# Altium project arduino_voltage_monitor_shield.PrjPCB
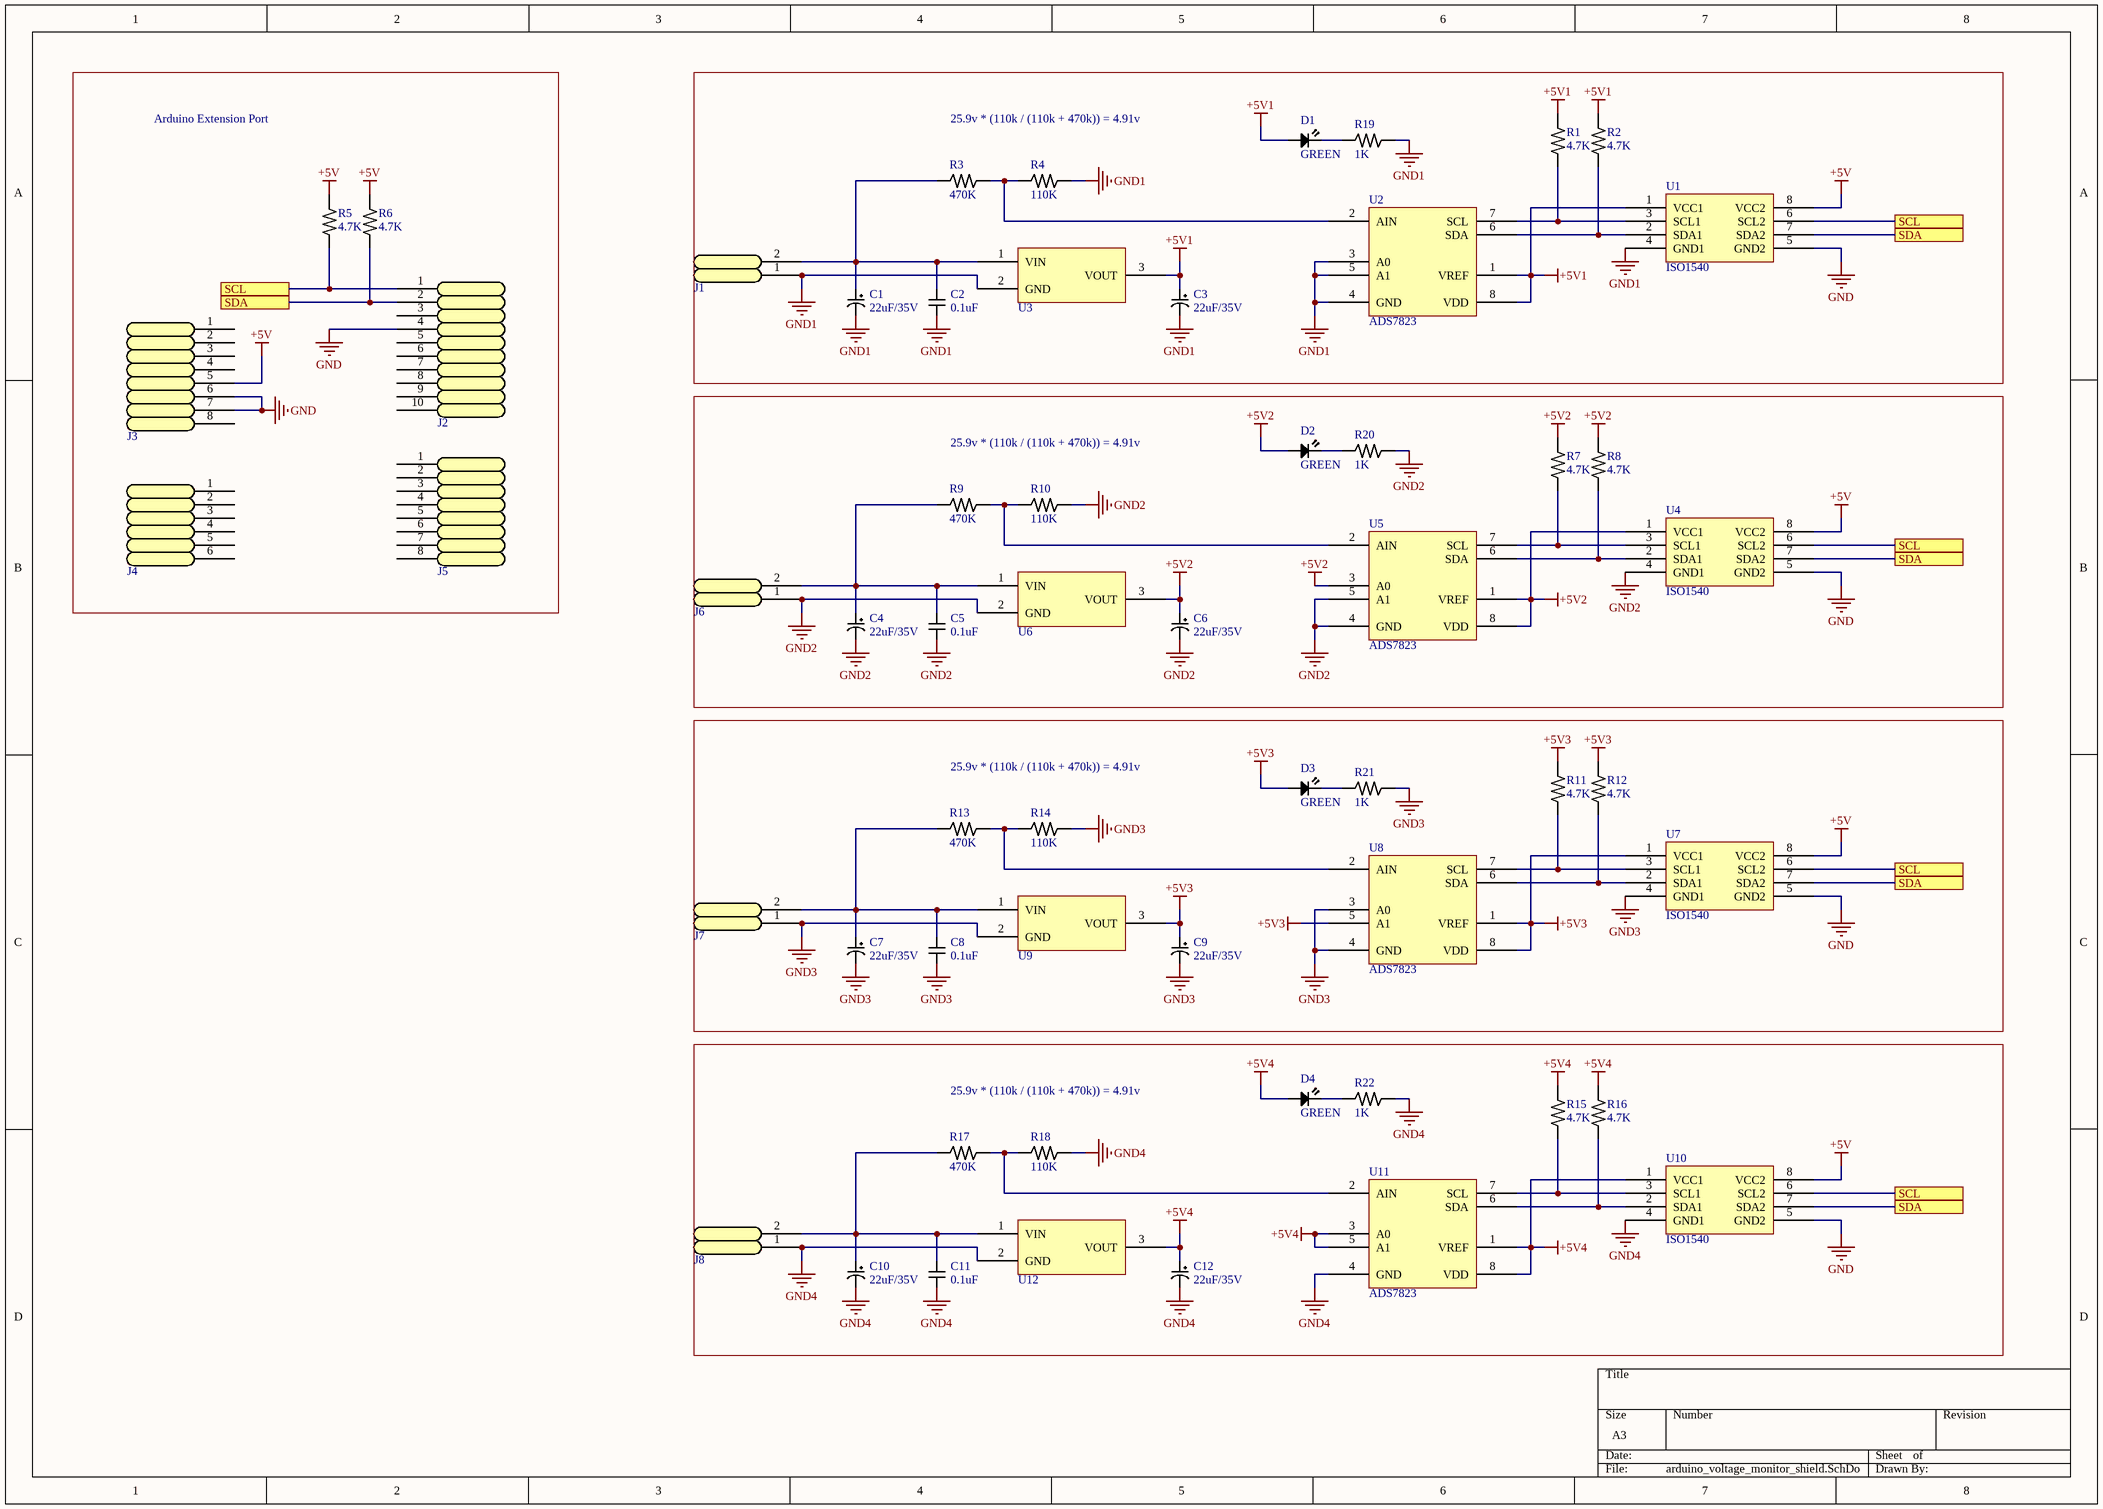
[diagram p0: arduino_voltage_monitor_shield.SchDoc]
1 sheet, 58 parts. Net scope: flat (ports and power ports of the same name join across sheets).
Board file: arduino_voltage_monitor_shield.PcbDoc

## Sheet arduino_voltage_monitor_shield.SchDoc
size A3

### Parts
C1  value 22uF/35V  [ECAP-TANTAL-A]  (hidden comment: EC)
C2  value 0.1uF  [CAP1608L]  (hidden comment: C)
C3  value 22uF/35V  [ECAP-TANTAL-A]  (hidden comment: EC)
C4  value 22uF/35V  [ECAP-TANTAL-A]  (hidden comment: EC)
C5  value 0.1uF  [CAP1608L]  (hidden comment: C)
C6  value 22uF/35V  [ECAP-TANTAL-A]  (hidden comment: EC)
C7  value 22uF/35V  [ECAP-TANTAL-A]  (hidden comment: EC)
C8  value 0.1uF  [CAP1608L]  (hidden comment: C)
C9  value 22uF/35V  [ECAP-TANTAL-A]  (hidden comment: EC)
C10  value 22uF/35V  [ECAP-TANTAL-A]  (hidden comment: EC)
C11  value 0.1uF  [CAP1608L]  (hidden comment: C)
C12  value 22uF/35V  [ECAP-TANTAL-A]  (hidden comment: EC)
D1  value GREEN  [LED1608L]  (hidden comment: LED)
D2  value GREEN  [LED1608L]  (hidden comment: LED)
D3  value GREEN  [LED1608L]  (hidden comment: LED)
D4  value GREEN  [LED1608L]  (hidden comment: LED)
J1  CON2  [DG128-5.0-02P]  (value not drawn)
J2  CON10  [PIN-HEADER-2.54-10P]  (value not drawn)
J3  CON8  [PIN-HEADER-2.54-8P]  (value not drawn)
J4  CON6  [PIN-HEADER-2.54-6P]  (value not drawn)
J5  CON8  [PIN-HEADER-2.54-8P]  (value not drawn)
J6  CON2  [DG128-5.0-02P]  (value not drawn)
J7  CON2  [DG128-5.0-02P]  (value not drawn)
J8  CON2  [DG128-5.0-02P]  (value not drawn)
R1  value 4.7K  [RES1608L]  (hidden comment: R)
R2  value 4.7K  [RES1608L]  (hidden comment: R)
R3  value 470K  [RES1608L]  (hidden comment: R)
R4  value 110K  [RES1608L]  (hidden comment: R)
R5  value 4.7K  [RES1608L]  (hidden comment: R)
R6  value 4.7K  [RES1608L]  (hidden comment: R)
R7  value 4.7K  [RES1608L]  (hidden comment: R)
R8  value 4.7K  [RES1608L]  (hidden comment: R)
R9  value 470K  [RES1608L]  (hidden comment: R)
R10  value 110K  [RES1608L]  (hidden comment: R)
R11  value 4.7K  [RES1608L]  (hidden comment: R)
R12  value 4.7K  [RES1608L]  (hidden comment: R)
R13  value 470K  [RES1608L]  (hidden comment: R)
R14  value 110K  [RES1608L]  (hidden comment: R)
R15  value 4.7K  [RES1608L]  (hidden comment: R)
R16  value 4.7K  [RES1608L]  (hidden comment: R)
R17  value 470K  [RES1608L]  (hidden comment: R)
R18  value 110K  [RES1608L]  (hidden comment: R)
R19  value 1K  [RES1608L]  (hidden comment: R)
R20  value 1K  [RES1608L]  (hidden comment: R)
R21  value 1K  [RES1608L]  (hidden comment: R)
R22  value 1K  [RES1608L]  (hidden comment: R)
U1  ISO1540  [SOIC-8]
U2  ADS7823  [VSSOP-8_DGK]
U3  R-785.0-0.5  [R-785.0-0.5]  (value not drawn)
U4  ISO1540  [SOIC-8]
U5  ADS7823  [VSSOP-8_DGK]
U6  R-785.0-0.5  [R-785.0-0.5]  (value not drawn)
U7  ISO1540  [SOIC-8]
U8  ADS7823  [VSSOP-8_DGK]
U9  R-785.0-0.5  [R-785.0-0.5]  (value not drawn)
U10  ISO1540  [SOIC-8]
U11  ADS7823  [VSSOP-8_DGK]
U12  R-785.0-0.5  [R-785.0-0.5]  (value not drawn)

### Blocks framed on the sheet
Arduino Extension Port: J2-J5 R5 R6
25.9v * (110k / (110k + 470k)) = 4.91v: C1-C3 D1 J1 R1-R4 R19 U1-U3
25.9v * (110k / (110k + 470k)) = 4.91v: C4-C6 D2 J6 R7-R10 R20 U4-U6
25.9v * (110k / (110k + 470k)) = 4.91v: C7-C9 D3 J7 R11-R14 R21 U7-U9
25.9v * (110k / (110k + 470k)) = 4.91v: C10-C12 D4 J8 R15-R18 R22 U10-U12

### Ports
SCL, SDA

### Nets
+5V: J3.5 R5.2 R6.2 U1.8(VCC2) U4.8(VCC2) U7.8(VCC2) U10.8(VCC2)
+5V1: C3.1 D1.2 R1.2 R2.2 U1.1(VCC1) U2.1(VREF) U2.8(VDD) U3.3(VOUT)
+5V2: C6.1 D2.2 R7.2 R8.2 U4.1(VCC1) U5.1(VREF) U5.3(A0) U5.8(VDD) U6.3(VOUT)
+5V3: C9.1 D3.2 R11.2 R12.2 U7.1(VCC1) U8.1(VREF) U8.5(A1) U8.8(VDD) U9.3(VOUT)
+5V4: C12.1 D4.2 R15.2 R16.2 U10.1(VCC1) U11.1(VREF) U11.3(A0) U11.5(A1) U11.8(VDD) U12.3(VOUT)
GND: J2.4 J3.6 J3.7 U1.5(GND2) U4.5(GND2) U7.5(GND2) U10.5(GND2)
GND1: C1.2 C2.1 C3.2 J1.1 R4.2 R19.2 U1.4(GND1) U2.3(A0) U2.4(GND) U2.5(A1) U3.2(GND)
GND2: C4.2 C5.1 C6.2 J6.1 R10.2 R20.2 U4.4(GND1) U5.4(GND) U5.5(A1) U6.2(GND)
GND3: C7.2 C8.1 C9.2 J7.1 R14.2 R21.2 U7.4(GND1) U8.3(A0) U8.4(GND) U9.2(GND)
GND4: C10.2 C11.1 C12.2 J8.1 R18.2 R22.2 U10.4(GND1) U11.4(GND) U12.2(GND)
NetC1_1: C1.1 C2.2 J1.2 R3.1 U3.1(VIN)
NetC4_1: C4.1 C5.2 J6.2 R9.1 U6.1(VIN)
NetC7_1: C7.1 C8.2 J7.2 R13.1 U9.1(VIN)
NetC10_1: C10.1 C11.2 J8.2 R17.1 U12.1(VIN)
NetD1_1: D1.1 R19.1
NetD2_1: D2.1 R20.1
NetD3_1: D3.1 R21.1
NetD4_1: D4.1 R22.1
NetJ2_1: J2.1 R5.1 U1.6(SCL2) U4.6(SCL2) U7.6(SCL2) U10.6(SCL2) ; port SCL
NetJ2_2: J2.2 R6.1 U1.7(SDA2) U4.7(SDA2) U7.7(SDA2) U10.7(SDA2) ; port SDA
NetR1_1: R1.1 U1.3(SCL1) U2.7(SCL)
NetR2_1: R2.1 U1.2(SDA1) U2.6(SDA)
NetR3_2: R3.2 R4.1 U2.2(AIN)
NetR7_1: R7.1 U4.3(SCL1) U5.7(SCL)
NetR8_1: R8.1 U4.2(SDA1) U5.6(SDA)
NetR9_2: R9.2 R10.1 U5.2(AIN)
NetR11_1: R11.1 U7.3(SCL1) U8.7(SCL)
NetR12_1: R12.1 U7.2(SDA1) U8.6(SDA)
NetR13_2: R13.2 R14.1 U8.2(AIN)
NetR15_1: R15.1 U10.3(SCL1) U11.7(SCL)
NetR16_1: R16.1 U10.2(SDA1) U11.6(SDA)
NetR17_2: R17.2 R18.1 U11.2(AIN)

Not connected (* = marked no-connect by the designer): J2 3 5 6 7 8 9 10; J3 1 2 3 4 8; J4 1 2 3 4 5 6; J5 1 2 3 4 5 6 7 8

### Library data of the parts
C1 C3 C4 C6 C7 C9 C10 C12 = EC: Polarized Capacitor
C2 C5 C8 C11 = C: Non-polarized Capacitor
D1-D4 = LED: Typical LED
J1 J6-J8 = CON2: Generic Connector 2 Pin
J2 = CON10: Generic Connector 10 Pin
J3 J5 = CON8: Generic Connector 8 Pin
J4 = CON6: Generic Connector 6 Pin
R1-R22 = R: Resistor
U1 U4 U7 U10 = ISO1540: ISO154x Low-Power Bidirectional I2C Isolators
U2 U5 U8 U11 = ADS7823: 12-Bit, Sampling A/D Converter with I2C™ INTERFACE
U3 U6 U9 U12 = R-785.0-0.5: R-78xx-Series high efficiency switching regulators